# Altium schematic sheet 5_dac.SchDoc: Analog Outputs
size A4; DocumentNumber: 6; SheetNumber: 6; SheetTotal: 11
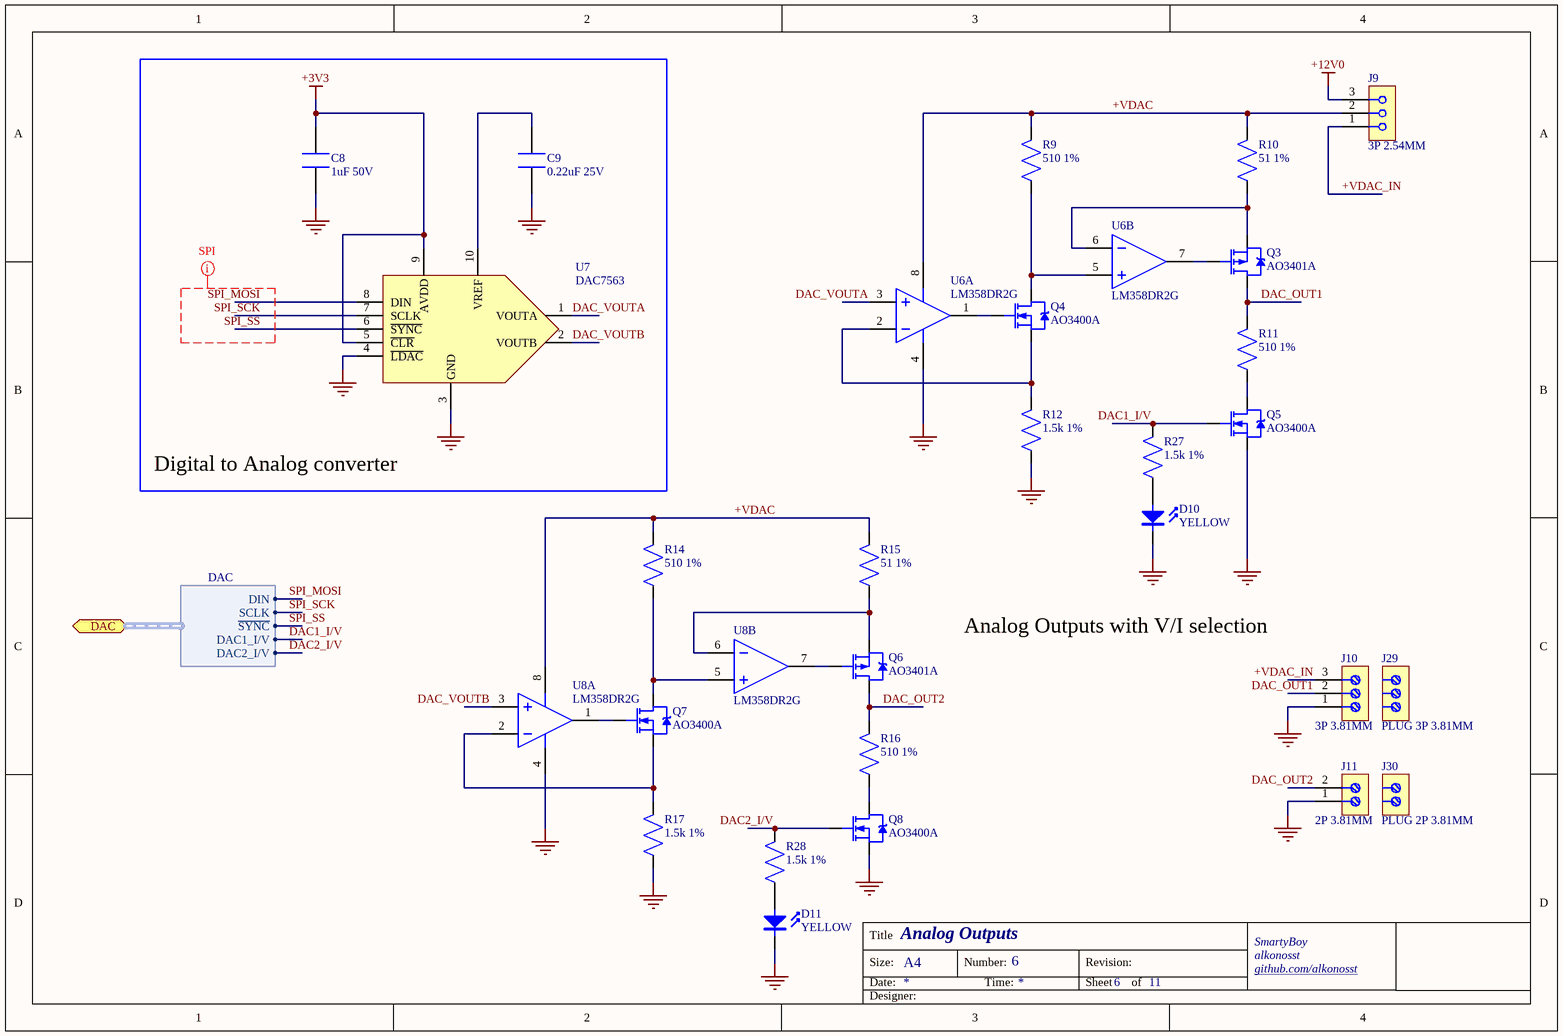
[diagram p0: 5_dac.SchDoc]

## Parts
C8  1uF 50V  [C0603]
C9  0.22uF 25V  [C0603]
D10  YELLOW  [LED0603-YELLOW]
D11  YELLOW  [LED0603-YELLOW]
J9  3P 2.54MM  [HDR-M-3P-2.54MM]
J10  3P 3.81MM  [TB-3P-3.81MM]  (no BOM)
J11  2P 3.81MM  [TB-2P-3.81MM]  (no BOM)
J29  PLUG 3P 3.81MM  [TB-PLUG-3P-3.81MM]  (no BOM)
J30  PLUG 2P 3.81MM  [TB-PLUG-2P-3.81MM]  (no BOM)
Q3  AO3401A  [SOT-23-3]
Q4  AO3400A  [SOT-23-3]
Q5  AO3400A  [SOT-23-3]
Q6  AO3401A  [SOT-23-3]
Q7  AO3400A  [SOT-23-3]
Q8  AO3400A  [SOT-23-3]
R9  510 1%  [R0603]
R10  51 1%  [R0603]
R11  510 1%  [R0603]
R12  1.5k 1%  [R0603]
R14  510 1%  [R0603]
R15  51 1%  [R0603]
R16  510 1%  [R0603]
R17  1.5k 1%  [R0603]
R27  1.5k 1%  [R0603]
R28  1.5k 1%  [R0603]
U6  LM358DR2G  [SOIC-8]  (parts A,B of 2)
U7  DAC7563  [VSSOP-10]
U8  LM358DR2G  [SOIC-8]  (parts A,B of 2)

## Blocks framed on the sheet
Digital to Analog converter: C8 C9 U7

## Ports
DAC (bidir, harness DAC)

## Harnesses
DAC: DIN, SCLK, ~{SYNC}, DAC1_I/V, DAC2_I/V

## Nets
+3V3: C8.1 U7.5(~{CLR}) U7.9(AVDD)
+12V0: J9.3
GND: C8.2 C9.2 D10.1 D11.1 J10.1 J11.1 Q5.2(S) Q8.2(S) R12.1 R17.1 U6.4(VSS) U7.3(GND) U7.4(~{LDAC}) U8.4(VSS)
+VDAC: J9.2 R9.2 R10.2 R14.2 R15.2 U6.8(VDD) U8.8(VDD)
+VDAC_IN: J9.1 J10.3
DAC1_I/V: Q5.1(G) R27.2 ; port DAC.DAC1_I/V
DAC2_I/V: Q8.1(G) R28.2 ; port DAC.DAC2_I/V
DAC_OUT1: J10.2 Q3.3(D) R11.2
DAC_OUT2: J11.2 Q6.3(D) R16.2
DAC_VOUTA: U6.3(IN1+) U7.1(VOUTA)
DAC_VOUTB: U7.2(VOUTB) U8.3(IN1+)
SPI_MOSI: U7.8(DIN) ; port DAC.DIN
SPI_SCK: U7.7(SCLK) ; port DAC.SCLK
SPI_SS: U7.6(~{SYNC}) ; port DAC.~{SYNC}
NetC9_1: C9.1 U7.10(VREF)
NetD10_2: D10.2 R27.1
NetD11_2: D11.2 R28.1
NetQ3_1: Q3.1(G) U6.7(OUT2)
NetQ3_2: Q3.2(S) R10.1 U6.6(IN2-)
NetQ4_1: Q4.1(G) U6.1(OUT1)
NetQ4_2: Q4.2(S) R12.2 U6.2(IN1-)
NetQ4_3: Q4.3(D) R9.1 U6.5(IN2+)
NetQ5_3: Q5.3(D) R11.1
NetQ6_1: Q6.1(G) U8.7(OUT2)
NetQ6_2: Q6.2(S) R15.1 U8.6(IN2-)
NetQ7_1: Q7.1(G) U8.1(OUT1)
NetQ7_2: Q7.2(S) R17.2 U8.2(IN1-)
NetQ7_3: Q7.3(D) R14.1 U8.5(IN2+)
NetQ8_3: Q8.3(D) R16.1

## Layout directives
net class SPI: SPI_MOSI, SPI_SCK, SPI_SS

## Notes on the sheet
- (near J10) Analog Outputs with V/I selection
- Title
- Size:
- Date:
- A4
- Number:
- Time:
- Revision:
- Sheet
- of
- SmartyBoy
- alkonosst
- github.com/alkonosst <http://github.com/alkonosst>
- Designer:

## Library data of the parts
C8 = CL10A105KB8NNNC: X5R ±10% 50V 1uF 0603 Multilayer Ceramic Capacitors MLCC - SMD/SMT; LCSC part: C15849; Category: Capacitors: Multilayer Ceramic Capacitors MLCC - SMD/SMT
C9 = CL10B224KA8NNNC: X7R 25V ±10% 220nF 0603 Multilayer Ceramic Capacitors MLCC - SMD/SMT; LCSC part: C21120; Category: Capacitors: Multilayer Ceramic Capacitors MLCC - SMD/SMT
D10 D11 = 19-213/Y2C-CQ2R2L/3T(CY): Yellow 585.5~591.5nm 0603 Light Emitting Diodes (LED); LCSC part: C72038; Category: Optoelectronics: Light Emitting Diodes (LED)
J9 = C49257: 3 2.54mm Straight 1 Header，Breakaway Through Hole Pin Header & Female Header; LCSC part: C49257; Category: Connectors: Pin Header & Female Header
J10 = TBLOCK-3P-3.81MM: Terminal Block 3 Positions 3.81MM; Category: Connectors: Pluggable System Terminal Block
J11 = TBLOCK-2P-3.81MM: Terminal Block 2 Positions 3.81MM; Category: Connectors: Pluggable System Terminal Block
J29 = PLUG-3P-3.81MM: Terminal block plug 3positions 3.81mm; Category: Connectors: Pluggable System Terminal Block
J30 = PLUG-2P-3.81MM: Terminal block plug 2positions 3.81mm; Category: Connectors: Pluggable System Terminal Block
Q3 Q6 = AO3401A: 1.4W 0.044Ω 4.3A,10V 30V 1.3V 250uA P Channel 4A SOT-23-3L MOSFETs; Category: Transistors: MOSFETs; LCSC part: C15127
Q4 Q5 Q7 Q8 = AO3400A: 1.4W 0.0265Ω 5.7A,10V 30V 5.7A N Channel 1.5V 250uA SOT-23-3L MOSFETs; LCSC part: C20917; Category: Transistors: MOSFETs
R9 R11 R14 R16 = 0603WAF5100T5E: 510Ω ±1% ±100ppm/℃ 0.1W 0603 Chip Resistor - Surface Mount; LCSC part: C23193; Category: Resistors: Chip Resistor - Surface Mount
R10 R15 = 0603WAF510JT5E: ±1% ±200ppm/℃ 0.1W 51Ω 0603 Chip Resistor - Surface Mount; LCSC part: C23197; Category: Resistors: Chip Resistor - Surface Mount
R12 R17 R27 R28 = 0603WAF1501T5E: 1.5kΩ ±1% ±100ppm/℃ 0.1W 0603 Chip Resistor - Surface Mount; LCSC part: C22843; Category: Resistors: Chip Resistor - Surface Mount
U6 U8 = LM358DR2G: 1MHz 2 General Purpose 1.5mA 0.6 V/us 3V ~ 32V, ±1.5V ~ 16V SOIC-8_150mil General Purpose Amplifiers; Category: Amplifiers: General Purpose Amplifiers; LCSC part: C7950
U7 = DAC7563SDGSR: VSSOP-10 Digital To Analog Converters (DACs); LCSC part: C601656; Category: Data Converters: Digital To Analog Converters (DACs)